# Altium schematic sheet GSM.SchDoc: GSM
size A4; SheetNumber: 5
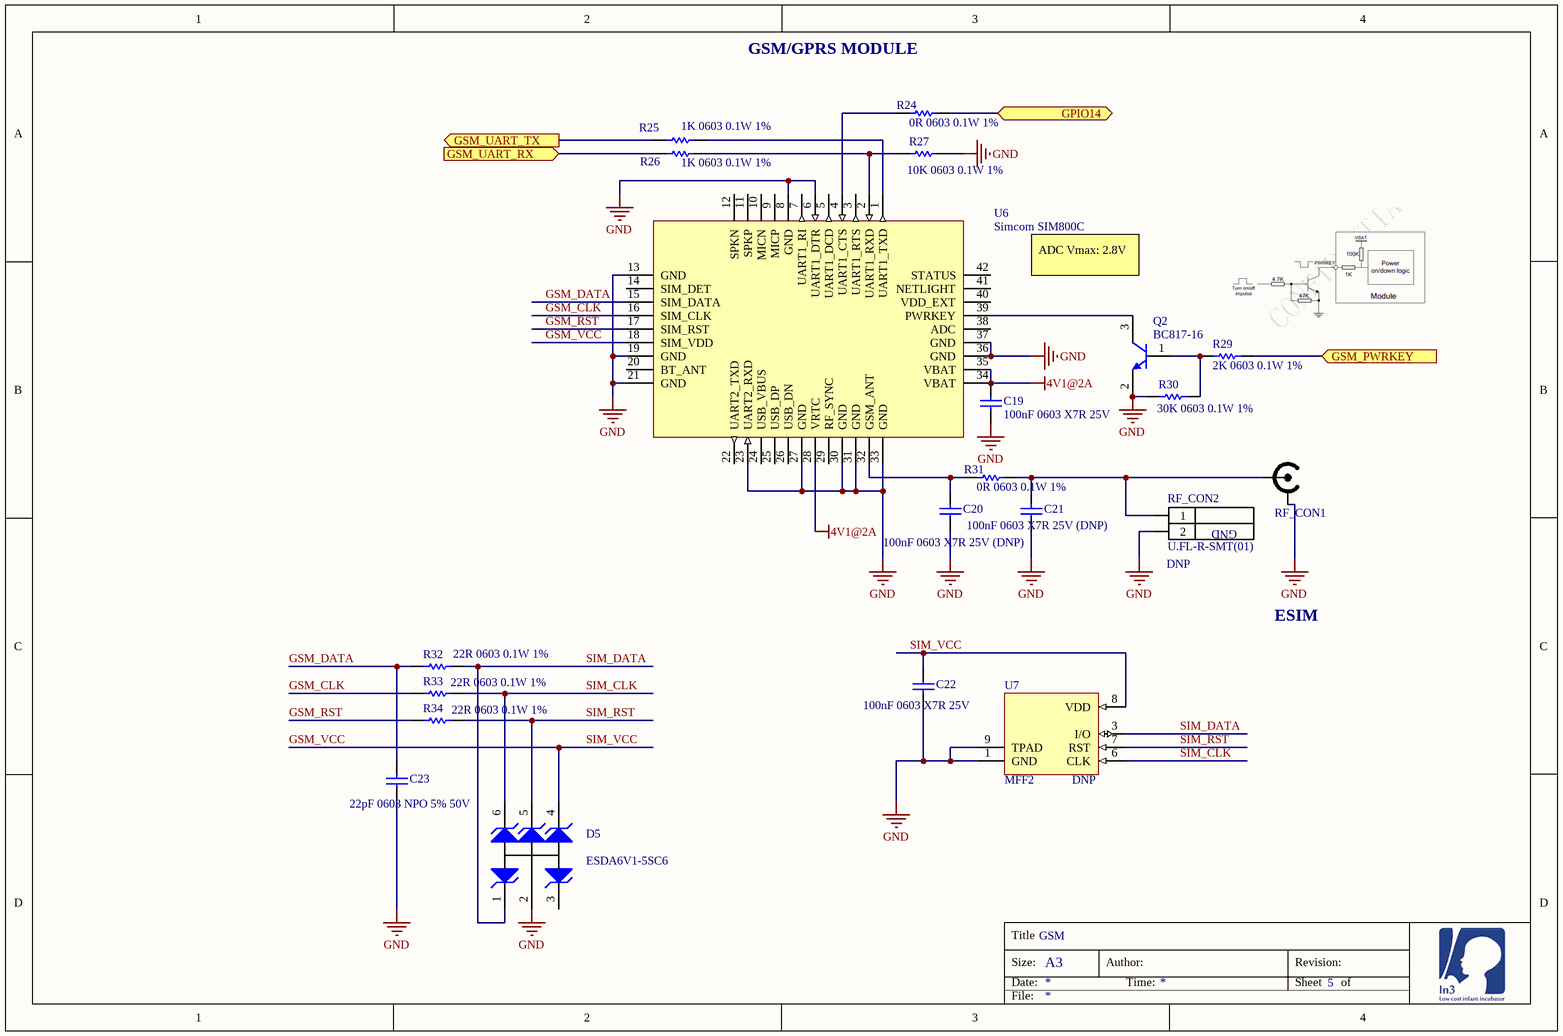
[diagram p0: GSM.SchDoc]

## Parts
C19  100nF 0603 X7R 25V  [CAPC1608X60X35NL10T15]
C20  100nF 0603 X7R 25V (DNP)  [CAPC1608X60X35NL10T15]  (no BOM)
C21  100nF 0603 X7R 25V (DNP)  [CAPC1608X60X35NL10T15]  (no BOM)
C22  100nF 0603 X7R 25V  [CAPC1608X60X35NL10T15]
C23  22pF 0603 NPO 5% 50V  [CAPC1608X60X35NL10T15]
D5  ESDA6V1-5SC6  [MF06A_N]
Q2  BC817-16  [PCB-856332-1]
R24  0R 0603 0.1W 1%  [RESC1609X55X30ML10T20]
R25  1K 0603 0.1W 1%  [RESC1609X55X30ML10T20]
R26  1K 0603 0.1W 1%  [RESC1609X55X30ML10T20]
R27  10K 0603 0.1W 1%  [RESC1609X55X30ML10T20]
R29  2K 0603 0.1W 1%  [RESC1609X55X30ML10T20]
R30  30K 0603 0.1W 1%  [RESC1609X55X30ML10T20]
R31  0R 0603 0.1W 1%  [RESC1609X55X30ML10T20]
R32  22R 0603 0.1W 1%  [RESC1609X55X30ML10T20]
R33  22R 0603 0.1W 1%  [RESC1609X55X30ML10T20]
R34  22R 0603 0.1W 1%  [RESC1609X55X30ML10T20]
RF_CON1  TE Connectivity 5-1814832-1  [PCB-gwgb3m8xi8a49txfo9ja-1]  (value not drawn)
RF_CON2  U.FL-R-SMT(01)  [PCB-ci0d6ius1xp1vci7q9ug-1]  (no BOM)
U6  Simcom SIM800C  [SIM800C]
U7  MFF2  [SON127P600X95_HS-9N]  (no BOM)

## Ports
GPIO14, GSM_PWRKEY (in), GSM_UART_RX (in), GSM_UART_TX (out)

## Nets
4V1@2A: C19.2 U6.28(VRTC) U6.34(VBAT) U6.35(VBAT)
GND: C19.1 C20.1 C21.1 C22.1 C23.1 D5.2(K) Q2.2(E) R27.2 R30.2 RF_CON1.2 RF_CON2.2 U6.6(UART1_DTR) U6.8(GND) U6.13(GND) U6.19(GND) U6.21(GND) U6.23(UART2_RXD) U6.27(GND) U6.30(GND) U6.31(GND) U6.33(GND) U6.36(GND) U6.37(GND) U7.1(GND) U7.9(TPAD)
GPIO14: R24.2 ; port GPIO14
GSM_CLK: R33.1 U6.16(SIM_CLK)
GSM_DATA: C23.2 R32.1 U6.15(SIM_DATA)
GSM_PWRKEY: R29.1 ; port GSM_PWRKEY
GSM_RST: R34.1 U6.17(SIM_RST)
GSM_UART_RX: R26.1 ; port GSM_UART_RX
GSM_UART_TX: R25.1 ; port GSM_UART_TX
GSM_VCC: C22.2 D5.4(A) U6.18(SIM_VDD) U7.8(VDD)  [also labelled SIM_VCC]
SIM_CLK: D5.6(A) R33.2 U7.6(CLK)
SIM_DATA: D5.1(K) R32.2 U7.3(I/O)
SIM_RST: D5.5(A) R34.2 U7.7(RST)
NetC20_2: C20.2 R31.1 U6.32(GSM_ANT)
NetC21_2: C21.2 R31.2 RF_CON1.1 RF_CON2.1
NetQ2_1: Q2.1(B) R29.2 R30.1
NetQ2_3: Q2.3(C) U6.39(PWRKEY)
NetR24_1: R24.1 U6.4(UART1_CTS)
NetR25_2: R25.2 U6.1(UART1_TXD)
NetR26_2: R26.2 R27.1 U6.2(UART1_RXD)

Not connected (* = marked no-connect by the designer): D5 3(K); U6 3(UART1_RTS) 5(UART1_DCD) 7(UART1_RI) 9(MICP) 10(MICN) 11(SPKP) 12(SPKN) 14(SIM_DET) 20(BT_ANT) 22(UART2_TXD) 24(USB_VBUS) 25(USB_DP) 26(USB_DN) 29(RF_SYNC) 38(ADC) 40(VDD_EXT) 41(NETLIGHT) 42(STATUS)

## Notes on the sheet
- GSM/GPRS MODULE
- ADC Vmax: 2.8V
- ESIM
- Title
- Size:
- Date:
- A3
- Author:
- Time:
- Revision:
- Sheet
- of
- File:
- (in symbol CMP-b06f7b3edcee6fa8-4) GND

## Library data of the parts
C19-C22 = CMP-c41a0d2b65641bdd-3: package: 0603; capacitance: 100 nF; Dielectric Characteristic: X7R
  C20 C21: DNP: DNP
C23 = CMP-126186-3: Manufacturer Part Number: 06035C220JAT2A; Dielectric Characteristic: X7R; Lead-Free Status: Lead Free; Voltage Rating (DC): 50.0 V; Capacitance: 22pF; Capacitance Tolerance: ±5%; Case/Package: 0603; Mounting Style: Surface Mount; Number of Pins: 2; Octopart Url: https://octopart.com/06035c220jat2a-avx+interconnect+%2F+elco-8599776; OctopartID: 0f6dc6e412ebd0aa; Packaging: Cut Tape (CT); REACH SVHC Compliance: No SVHC; RoHS: Compliant
D5 = CMP-924f5b40f9684d88-1: ESDA Series 5 Channel 6.1 V 50 pF SMT Uni Directional Transil Array - SOT-23-6L; Operating Voltage: 6.10 V; Power Rating: 100 W; Breakdown Voltage: 7.20 V; Lead-Free Status: Lead Free; REACH SVHC Compliance: No SVHC; Number of Pins: 6; Case/Package: SOT-23; Size-Width: 1.75 mm; Mounting Style: Surface Mount; Manufacturer Part Number: ESDA6V1-5SC6; Size-Height: 1.45 mm; OctopartID: 924f5b40f9684d88; Size-Length: 3.05 mm; Packaging: Tape & Reel (TR), Cut Tape (CT); Octopart URL: http://octopart.com/esda6v1-5sc6-stmicroelectronics-347713; RoHS: Compliant; Voltage Rating (DC): 6.10 V; Lifecycle Status: Active; TME: ESDA6V1-5SC6
Q2 = CMP-856332-3: TRANS NPN 45V 500mA SMD SOT23-3; Current Rating: 0.6 A; Lead-Free Status: Lead Free; Power Dissipation: 0.3 W; Voltage Rating (DC): 40.0 V; Case/Package: SOT-23; Lifecycle Status: Active; Mounting Style: Surface Mount; Number of Pins: 3; Octopart Url: https://octopart.com/mmbt2222a-7-f-diodes+inc.-357838; OctopartID: 53a79aa8030f8c60; Packaging: Cut Tape (CT); Polarity: NPN; REACH SVHC Compliance: No SVHC; RoHS: Compliant
R24 R31 = CMP-536b9a7387ce8cac-10: HelpURL: http://www.yageo.com/documents/recent/PYu-RC_Group_51_RoHS_L_9.pdf; Resistance: 0R; package: 0603
R25 R26 = CMP-a61f6f36030f79d8-4: Manufacturer Part Number: CR0603-FX-1001ELF; Power Rating: 100 mW; Case/Package (SI): 1608; Voltage Rating (DC): 50.0 V; Temperature Coefficient: -100 ppm/°C to 100 ppm/°C; REACH SVHC Compliance: No SVHC; Packaging: Tape & Reel (TR), Cut Tape (CT); Resistance Tolerance: ±1%; Resistance: 1k; RoHS: Compliant; Mounting Style: Surface Mount; Number of Pins: 2; Size-Length: 1.60 mm; Octopart URL: https://octopart.com/cr0603-fx-1001elf-bourns-2326646; Size-Thickness: 457 µm; OctopartID: a61f6f36030f79d8; Size-Width: 787 µm; Case/Package: 0603
R27 = CMP-4716590-9: Octopart Url: https://octopart.com/crcw060310k0fkeahp-vishay-42634028; package: 0603; Resistance: 10k; Tolerance: 1%
R29 R30 = CMP-3655986-6: Tolerance: 1%; package: 0603
  R29: Resistance: 2K
  R30: Resistance: 30k
R32-R34 = CMP-1846194-8: Tolerance: 1%; Value: 22R; package: 0603
RF_CON1 = CMP-578319-10: RF Connectors / Coaxial Connectors Str PCB Skt; ELV Compliant: Compliant; Dielectric Material: Teflon; REACH SVHC Compliance: No SVHC; Packaging: Box
RF_CON2 = CMP-b06f7b3edcee6fa8-4: Connector RF Coaxial Data Midget Coaxial; DNP: DNP
U6 = CMP-72dbb8ea0133ad1c-5: Module: GSM/Bluetooth; GPRS; 2G; 1800MHz, 900MHz; 85.6kbps; SMD; OctopartID: 72dbb8ea0133ad1c; Manufacturer Part Number: SIM800C; Mounting Style: Surface Mount; Octopart URL: http://octopart.com/sim800c-simcom-54220430
U7 = CMP-ce8f06c57f401148-2: Embedded SIM card in MFF2; DNP: DNP